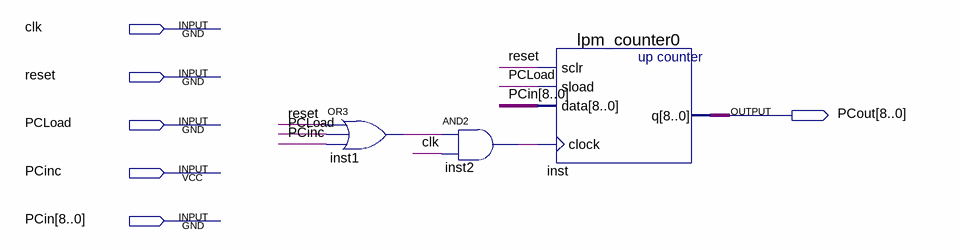
[diagram p0: schematic sheet]
// Quartus schematic PC.bdf as structural Verilog: 3 symbols, 6 pins
module PC (
  input  clk,
  input  reset,
  input  PCLoad,
  input  PCinc,
  input  [8:0] PCin,
  output [8:0] PCout
);

  wire inst1_out, inst2_out;

  or inst1 (inst1_out, reset, PCLoad, PCinc);
  and inst2 (inst2_out, inst1_out, clk);
  lpm_counter0 inst (.sclr(reset), .sload(PCLoad), .data(PCin), .clock(inst2_out), .q(PCout));
endmodule
